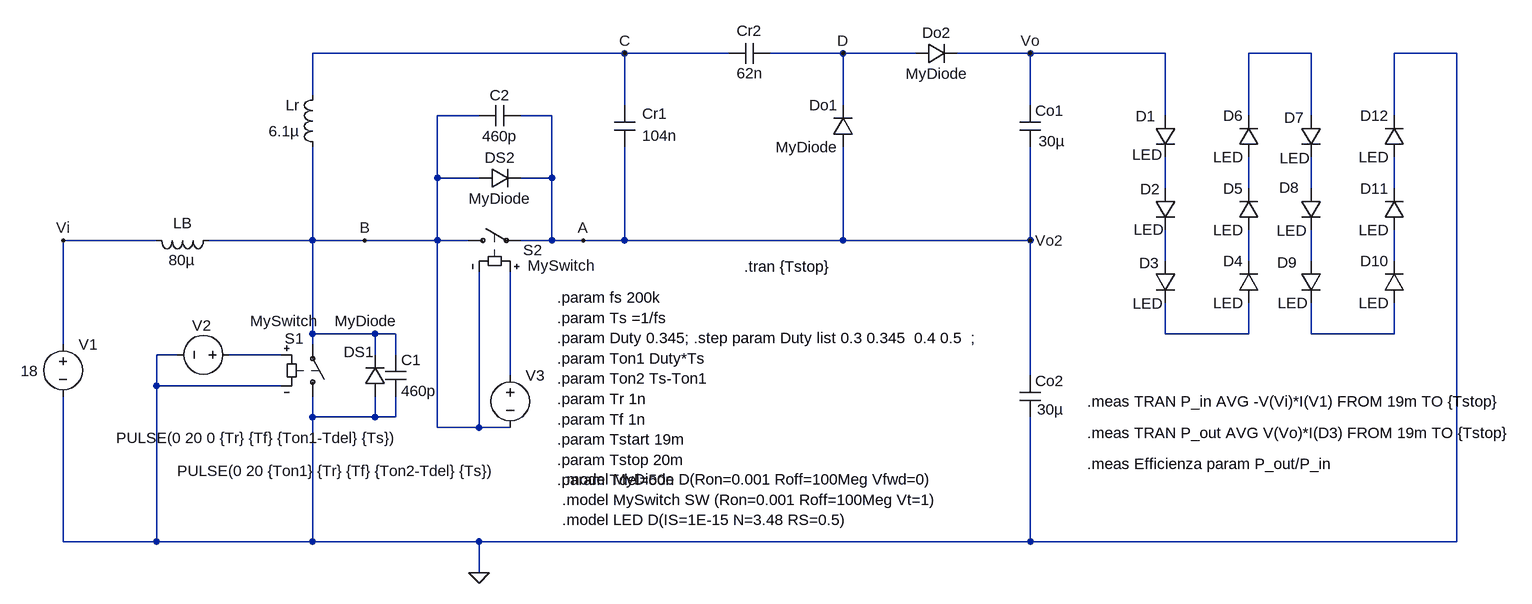
[diagram p0: schematic N_12_LED - Copia.asc]
N_12_LED - Copia.asc, the LTspice schematic file:
Version 4.1
SHEET 1 3448 2144
WIRE 352 -128 -128 -128
WIRE 512 -128 352 -128
WIRE 688 -128 576 -128
WIRE 800 -128 688 -128
WIRE 976 -128 864 -128
WIRE 1184 -128 976 -128
WIRE 1408 -128 1312 -128
WIRE 1632 -128 1536 -128
WIRE -128 -64 -128 -128
WIRE 352 -48 352 -128
WIRE 688 -48 688 -128
WIRE 976 -48 976 -128
WIRE 128 -32 64 -32
WIRE 240 -32 192 -32
WIRE 1184 -32 1184 -128
WIRE 1312 -32 1312 -128
WIRE 1408 -32 1408 -128
WIRE 1536 -32 1536 -128
WIRE 64 64 64 -32
WIRE 128 64 64 64
WIRE 240 64 240 -32
WIRE 240 64 192 64
WIRE 1184 80 1184 32
WIRE 1312 80 1312 32
WIRE 1408 80 1408 32
WIRE 1536 80 1536 32
WIRE -368 160 -512 160
WIRE -128 160 -128 16
WIRE -128 160 -288 160
WIRE -48 160 -128 160
WIRE 64 160 64 64
WIRE 64 160 -48 160
WIRE 112 160 64 160
WIRE 240 160 240 64
WIRE 240 160 192 160
WIRE 288 160 240 160
WIRE 352 160 352 16
WIRE 352 160 288 160
WIRE 688 160 688 16
WIRE 688 160 352 160
WIRE 976 160 976 16
WIRE 976 160 688 160
WIRE 1184 192 1184 144
WIRE 1312 192 1312 144
WIRE 1408 192 1408 144
WIRE 1536 192 1536 144
WIRE -128 304 -128 160
WIRE -32 304 -128 304
WIRE 0 304 -32 304
WIRE 1184 304 1184 256
WIRE 1312 304 1312 256
WIRE 1312 304 1184 304
WIRE 1408 304 1408 256
WIRE 1536 304 1536 256
WIRE 1536 304 1408 304
WIRE -512 320 -512 160
WIRE -128 320 -128 304
WIRE -336 336 -368 336
WIRE -176 336 -256 336
WIRE -32 336 -32 304
WIRE 0 336 0 304
WIRE 176 368 176 208
WIRE 976 368 976 160
WIRE -368 384 -368 336
WIRE -176 384 -368 384
WIRE -128 432 -128 400
WIRE -32 432 -32 400
WIRE -32 432 -128 432
WIRE 0 432 0 400
WIRE 0 432 -32 432
WIRE 64 448 64 160
WIRE 128 448 128 208
WIRE 128 448 64 448
WIRE 176 448 128 448
WIRE -512 624 -512 400
WIRE -368 624 -368 384
WIRE -368 624 -512 624
WIRE -128 624 -128 432
WIRE -128 624 -368 624
WIRE 128 624 -128 624
WIRE 976 624 976 432
WIRE 976 624 128 624
WIRE 1632 624 1632 -128
WIRE 1632 624 976 624
WIRE 128 672 128 624
FLAG 128 672 0
FLAG 976 -128 Vo
FLAG -512 160 Vi
FLAG 976 160 Vo2
FLAG 288 160 A
FLAG -48 160 B
FLAG 352 -128 C
FLAG 688 -128 D
SYMBOL cap 336 -48 R0
WINDOW 0 43 13 Left 2
WINDOW 3 43 47 Left 2
SYMATTR InstName Cr1
SYMATTR Value 104n
SYMBOL cap 576 -144 R90
WINDOW 0 -3 32 VBottom 2
WINDOW 3 62 31 VBottom 2
SYMATTR InstName Cr2
SYMATTR Value 62n
SYMBOL cap 960 -48 R0
WINDOW 3 29 55 Left 2
SYMATTR Value 30µ
SYMATTR InstName Co1
SYMBOL cap 960 368 R0
WINDOW 3 27 52 Left 2
SYMATTR Value 30µ
SYMATTR InstName Co2
SYMBOL ind -112 32 R180
WINDOW 3 36 40 Left 2
WINDOW 0 36 80 Left 2
SYMATTR Value 6.1µ
SYMATTR InstName Lr
SYMBOL ind -384 144 M90
WINDOW 0 5 56 VBottom 2
WINDOW 3 62 55 VBottom 2
SYMATTR InstName LB
SYMATTR Value 80µ
SYMBOL voltage -512 304 R0
WINDOW 123 0 0 Left 0
WINDOW 39 0 0 Left 0
WINDOW 3 -65 57 Left 2
SYMATTR Value 18
SYMATTR InstName V1
SYMBOL voltage -240 336 R90
WINDOW 123 0 0 Left 0
WINDOW 39 0 0 Left 0
WINDOW 3 128 -248 VRight 2
WINDOW 0 -45 44 VRight 2
SYMATTR Value PULSE(0 20 0 {Tr} {Tf} {Ton1-Tdel} {Ts})
SYMATTR InstName V2
SYMBOL voltage 176 352 R0
WINDOW 123 0 0 Left 0
WINDOW 39 0 0 Left 0
WINDOW 3 -512 163 Left 2
SYMATTR Value PULSE(0 20 {Ton1} {Tr} {Tf} {Ton2-Tdel} {Ts})
SYMATTR InstName V3
SYMBOL sw -128 416 M180
WINDOW 0 -43 105 Left 2
WINDOW 3 -96 132 Left 2
SYMATTR InstName S1
SYMATTR Value MySwitch
SYMBOL sw 96 160 R270
WINDOW 0 -15 129 VLeft 2
WINDOW 3 -39 210 VLeft 2
SYMATTR InstName S2
SYMATTR Value MySwitch
SYMBOL diode 704 16 R180
WINDOW 0 24 64 Left 2
WINDOW 3 24 0 Left 2
SYMATTR InstName Do1
SYMATTR Value MyDiode
SYMBOL diode 800 -112 R270
WINDOW 0 32 32 VTop 2
WINDOW 3 0 32 VBottom 2
SYMATTR InstName Do2
SYMATTR Value MyDiode
SYMBOL diode 1168 -32 R0
WINDOW 0 -30 1 Left 2
WINDOW 3 -35 60 Left 2
SYMATTR InstName D1
SYMATTR Value LED
SYMBOL diode 1168 80 R0
WINDOW 0 -23 1 Left 2
WINDOW 3 -33 63 Left 2
SYMATTR InstName D2
SYMATTR Value LED
SYMBOL diode 1168 192 R0
WINDOW 0 -24 3 Left 2
WINDOW 3 -34 65 Left 2
SYMATTR InstName D3
SYMATTR Value LED
SYMBOL diode 1328 256 R180
WINDOW 0 24 64 Left 2
WINDOW 3 24 0 Left 2
SYMATTR InstName D4
SYMATTR Value LED
SYMBOL diode 1328 144 R180
WINDOW 0 24 64 Left 2
WINDOW 3 24 0 Left 2
SYMATTR InstName D5
SYMATTR Value LED
SYMBOL diode 1328 32 R180
WINDOW 0 24 64 Left 2
WINDOW 3 24 0 Left 2
SYMATTR InstName D6
SYMATTR Value LED
SYMBOL diode 1392 -32 R0
WINDOW 0 -25 3 Left 2
WINDOW 3 -32 65 Left 2
SYMATTR InstName D7
SYMATTR Value LED
SYMBOL diode 1392 80 R0
WINDOW 0 -33 -1 Left 2
WINDOW 3 -37 65 Left 2
SYMATTR InstName D8
SYMATTR Value LED
SYMBOL diode 1392 192 R0
WINDOW 0 -36 2 Left 2
WINDOW 3 -35 64 Left 2
SYMATTR InstName D9
SYMATTR Value LED
SYMBOL diode 1552 256 R180
WINDOW 0 24 64 Left 2
WINDOW 3 24 0 Left 2
SYMATTR InstName D10
SYMATTR Value LED
SYMBOL diode 1552 144 R180
WINDOW 0 24 64 Left 2
WINDOW 3 24 0 Left 2
SYMATTR InstName D11
SYMATTR Value LED
SYMBOL diode 1552 32 R180
WINDOW 0 24 64 Left 2
WINDOW 3 24 0 Left 2
SYMATTR InstName D12
SYMATTR Value LED
SYMBOL diode 128 80 R270
WINDOW 0 32 32 VTop 2
WINDOW 3 0 32 VBottom 2
SYMATTR InstName DS2
SYMATTR Value MyDiode
SYMBOL diode -16 400 R180
WINDOW 0 18 68 Left 2
WINDOW 3 -17 116 Left 2
SYMATTR InstName DS1
SYMATTR Value MyDiode
SYMBOL cap -16 336 R0
SYMATTR InstName C1
SYMATTR Value 460p
SYMBOL cap 192 -48 R90
WINDOW 0 0 32 VBottom 2
WINDOW 3 32 32 VTop 2
SYMATTR InstName C2
SYMATTR Value 460p
TEXT 536 200 Left 2 !.tran {Tstop}
TEXT 248 248 Left 2 !.param fs 200k\n.param Ts =1/fs\n.param Duty 0.345; .step param Duty list 0.3 0.345  0.4 0.5  ;\n.param Ton1 Duty*Ts\n.param Ton2 Ts-Ton1\n.param Tr 1n\n.param Tf 1n\n.param Tstart 19m\n.param Tstop 20m\n.param Tdel=50n
TEXT 256 528 Left 2 !.model MyDiode D(Ron=0.001 Roff=100Meg Vfwd=0)\n.model MySwitch SW (Ron=0.001 Roff=100Meg Vt=1)\n.model LED D(IS=1E-15 N=3.48 RS=0.5)
TEXT 1064 408 Left 2 !.meas TRAN P_in AVG -V(Vi)*I(V1) FROM 19m TO {Tstop}
TEXT 1064 456 Left 2 !.meas TRAN P_out AVG V(Vo)*I(D3) FROM 19m TO {Tstop}
TEXT 1064 504 Left 2 !.meas Efficienza param P_out/P_in

The netlist it stands for:
* N_12_LED - Copia.asc
Cr1 C A 104n
Cr2 D C 62n
Co1 Vo A 30µ
Co2 A 0 30µ
Lr B C 6.1µ
LB Vi B 80µ
V1 Vi 0 18
V2 N012 0 PULSE(0 20 0 {Tr} {Tf} {Ton1-Tdel} {Ts})
V3 N013 B PULSE(0 20 {Ton1} {Tr} {Tf} {Ton2-Tdel} {Ts})
S1 0 B N012 0 MySwitch
S2 B A N013 B MySwitch
Do1 A D MyDiode
Do2 D Vo MyDiode
D1 Vo N002 LED
D2 N002 N006 LED
D3 N006 N010 LED
D4 N010 N007 LED
D5 N007 N003 LED
D6 N003 N001 LED
D7 N001 N004 LED
D8 N004 N008 LED
D9 N008 N011 LED
D10 N011 N009 LED
D11 N009 N005 LED
D12 N005 0 LED
DS2 B A MyDiode
DS1 0 B MyDiode
C1 B 0 460p
C2 A B 460p
.model D D
.lib standard.dio
.tran {Tstop}
.param fs 200k
.param Ts =1/fs
.param Duty 0.345; .step param Duty list 0.3 0.345  0.4 0.5  ;
.param Ton1 Duty*Ts
.param Ton2 Ts-Ton1
.param Tr 1n
.param Tf 1n
.param Tstart 19m
.param Tstop 20m
.param Tdel=50n
.model MyDiode D(Ron=0.001 Roff=100Meg Vfwd=0)
.model MySwitch SW (Ron=0.001 Roff=100Meg Vt=1)
.model LED D(IS=1E-15 N=3.48 RS=0.5)
.meas TRAN P_in AVG -V(Vi)*I(V1) FROM 19m TO {Tstop}
.meas TRAN P_out AVG V(Vo)*I(D3) FROM 19m TO {Tstop}
.meas Efficienza param P_out/P_in
.backanno
.end